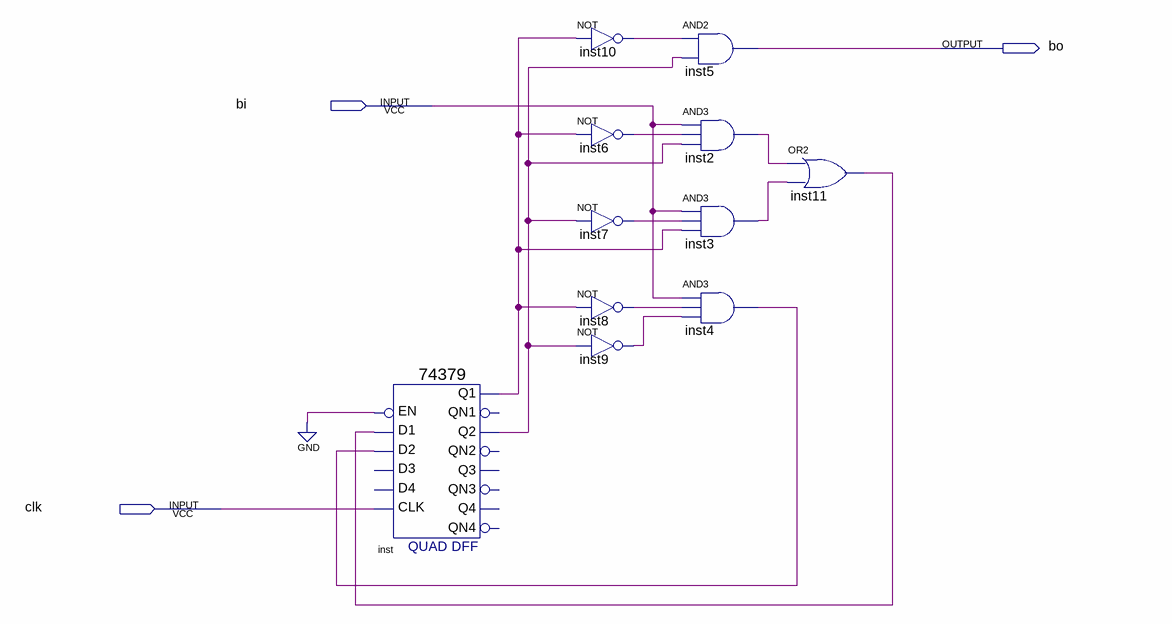
[diagram p0: schematic sheet]
// Quartus schematic sinc_butao.bdf as structural Verilog: 11 symbols, 3 pins
module sinc_butao (
  input  bi,
  input  clk,
  output bo
);

  wire inst2_out, inst3_out, inst4_out, inst6_out, inst7_out, inst8_out, inst9_out, inst10_out, inst11_out,
       inst_q1, inst_q2;

  \74379  inst (
    .D1(inst11_out), .EN(1'b0), .D2(inst4_out), .CLK(clk), .Q2(inst_q2), .Q1(inst_q1));  // open: D3, D4, QN4, Q4, QN2, Q3, QN3, QN1
  not inst10 (inst10_out, inst_q1);
  not inst6 (inst6_out, inst_q1);
  not inst7 (inst7_out, inst_q2);
  not inst8 (inst8_out, inst_q1);
  not inst9 (inst9_out, inst_q2);
  and inst5 (bo, inst10_out, inst_q2);
  and inst2 (inst2_out, bi, inst6_out, inst_q2);
  and inst3 (inst3_out, bi, inst7_out, inst_q1);
  and inst4 (inst4_out, bi, inst8_out, inst9_out);
  or inst11 (inst11_out, inst2_out, inst3_out);
endmodule
